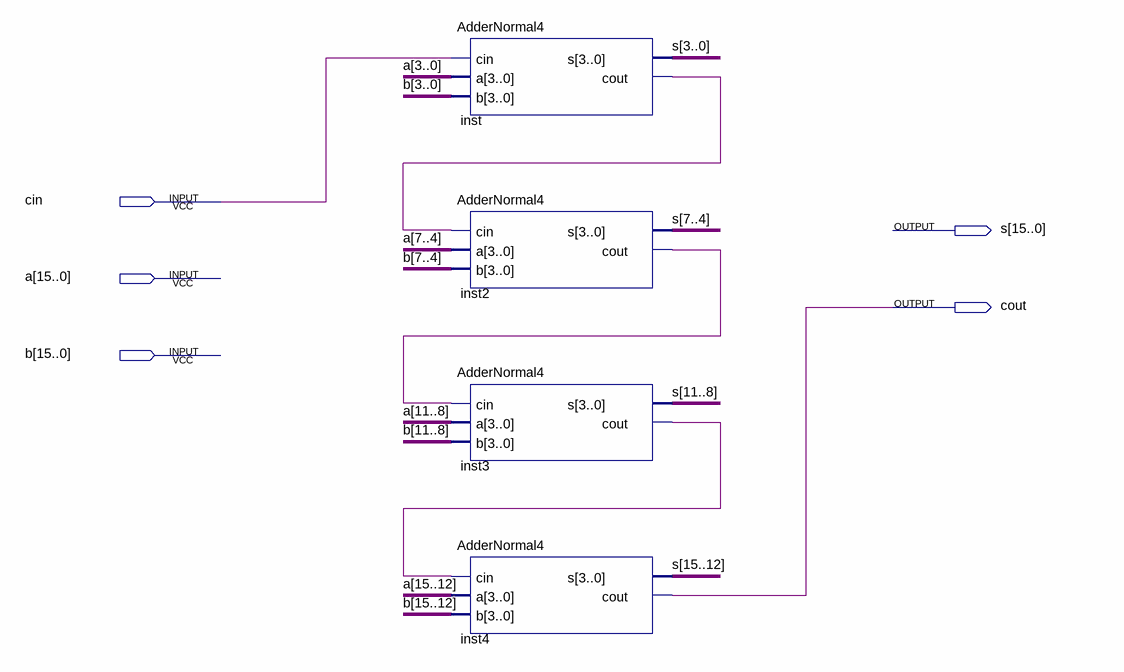
[diagram p0: schematic sheet]
// Quartus schematic AdderNormal16.bdf as structural Verilog: 4 symbols, 5 pins
module AdderNormal16 (
  input  cin,
  input  [15:0] a,
  input  [15:0] b,
  output [15:0] s,
  output cout
);

  wire inst2_cout, inst3_cout, inst_cout;

  AdderNormal4 inst (.cin(cin), .a(a[3:0]), .b(b[3:0]), .s(s[3:0]), .cout(inst_cout));
  AdderNormal4 inst2 (.cin(inst_cout), .a(a[7:4]), .b(b[7:4]), .s(s[7:4]), .cout(inst2_cout));
  AdderNormal4 inst3 (.cin(inst2_cout), .a(a[11:8]), .b(b[11:8]), .s(s[11:8]), .cout(inst3_cout));
  AdderNormal4 inst4 (.cin(inst3_cout), .a(a[15:12]), .b(b[15:12]), .s(s[15:12]), .cout(cout));
endmodule
